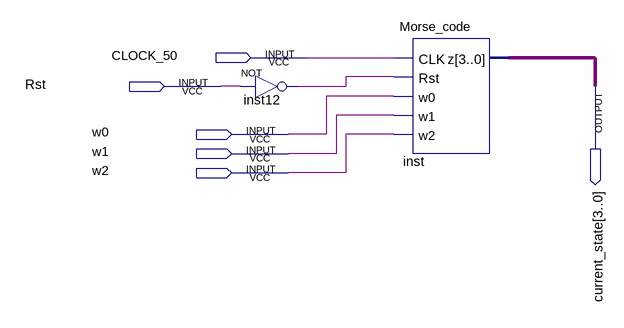
[diagram p0: schematic sheet]
// Quartus schematic Block2.bdf as structural Verilog: 2 symbols, 6 pins
module Block2 (
  input  CLOCK_50,
  input  Rst,
  input  w0,
  input  w1,
  input  w2,
  output [3:0] current_state
);

  wire inst12_out;

  not inst12 (inst12_out, Rst);
  Morse_code inst (.CLK(CLOCK_50), .Rst(inst12_out), .w0(w0), .w1(w1), .w2(w2), .z(current_state));
endmodule
